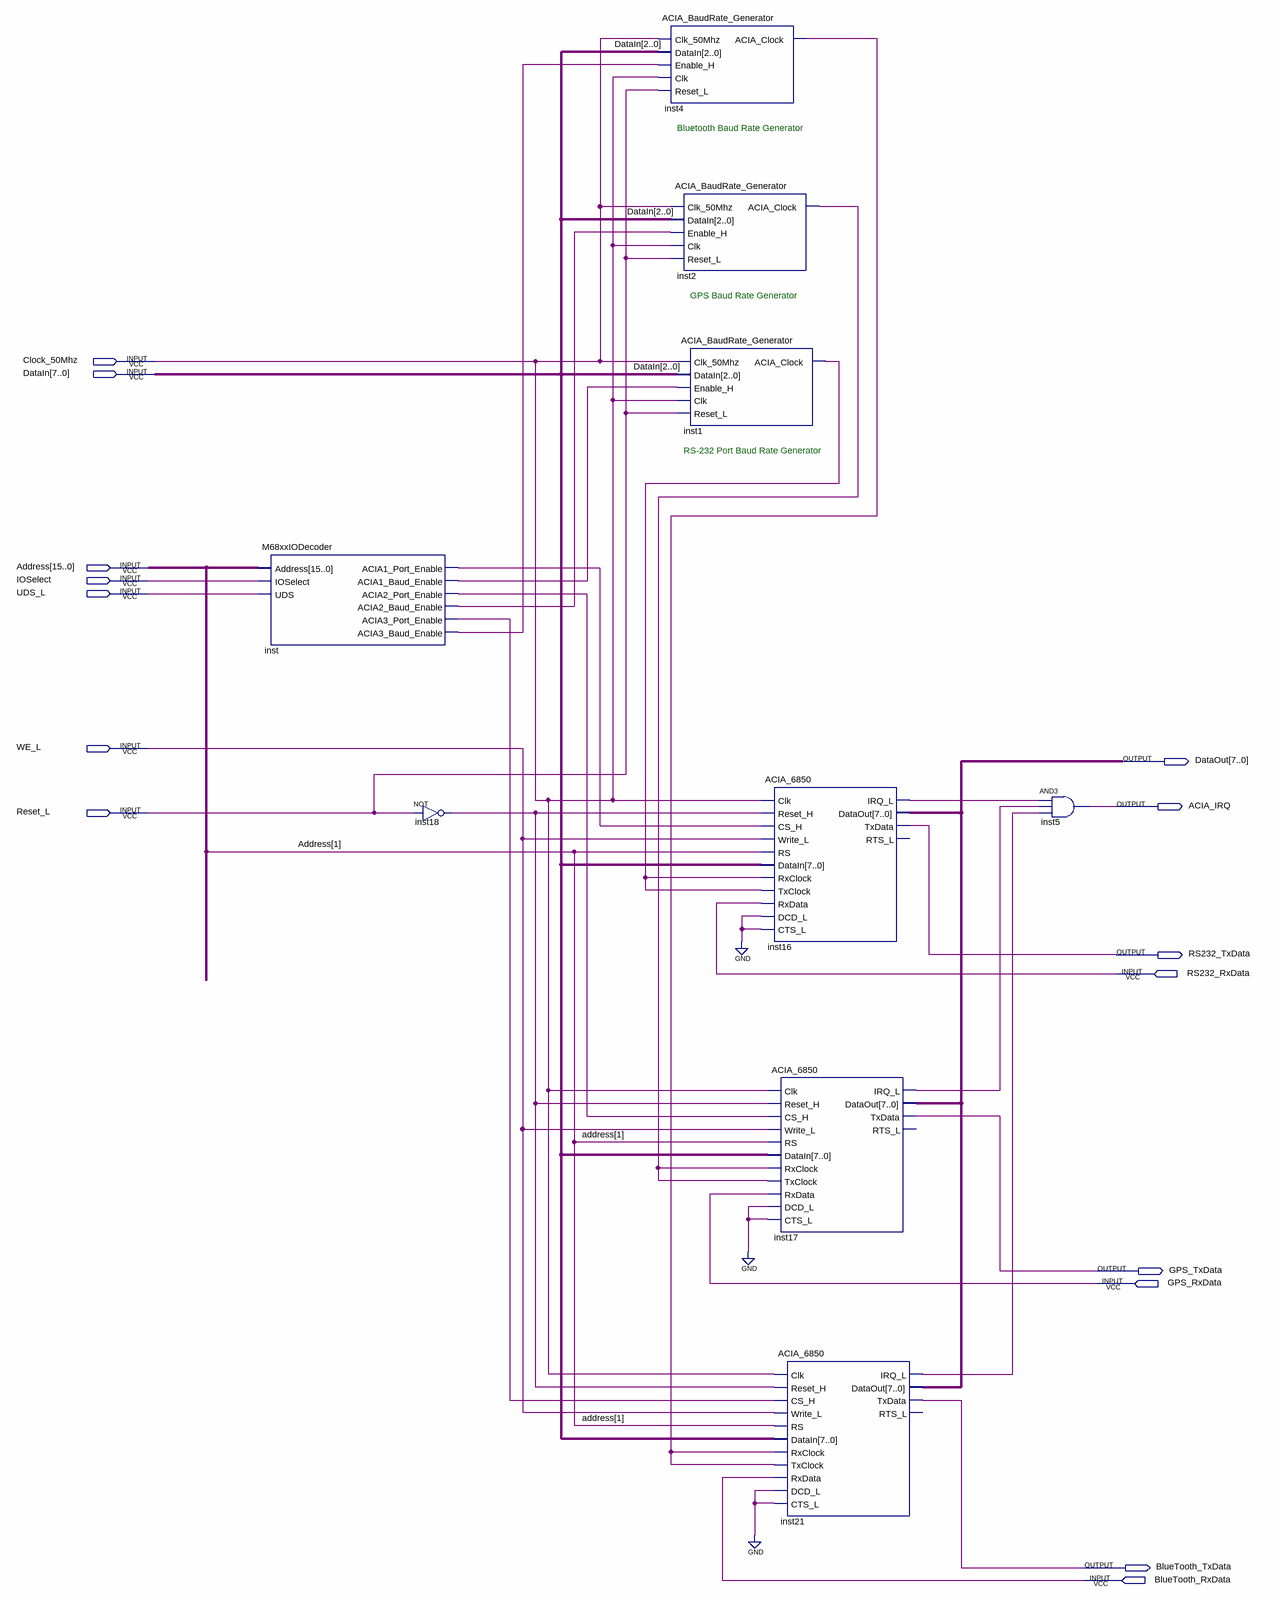
[diagram p0: schematic sheet]
// Quartus schematic OnChipM68xxIO.bdf as structural Verilog: 9 symbols, 15 pins
module OnChipM68xxIO (
  input  Clock_50Mhz,
  input  [7:0] DataIn,
  input  [15:0] Address,
  input  IOSelect,
  input  UDS_L,
  input  WE_L,
  input  Reset_L,
  input  RS232_RxData,
  input  GPS_RxData,
  input  BlueTooth_RxData,
  output [7:0] DataOut,
  output ACIA_IRQ,
  output RS232_TxData,
  output GPS_TxData,
  output BlueTooth_TxData
);

  wire inst1_acia_clock, inst2_acia_clock, inst4_acia_clock, inst16_irq_l, inst17_irq_l, inst18_out,
       inst21_irq_l, inst_acia1_baud_enable, inst_acia1_port_enable, inst_acia2_baud_enable,
       inst_acia2_port_enable, inst_acia3_baud_enable, inst_acia3_port_enable;

  M68xxIODecoder inst (
    .Address(Address), .IOSelect(IOSelect), .UDS(UDS_L), .ACIA1_Port_Enable(inst_acia1_port_enable),
    .ACIA1_Baud_Enable(inst_acia1_baud_enable), .ACIA2_Port_Enable(inst_acia2_port_enable),
    .ACIA2_Baud_Enable(inst_acia2_baud_enable), .ACIA3_Port_Enable(inst_acia3_port_enable),
    .ACIA3_Baud_Enable(inst_acia3_baud_enable));
  not inst18 (inst18_out, Reset_L);
  ACIA_BaudRate_Generator inst4 (
    .Clk_50Mhz(Clock_50Mhz), .DataIn(DataIn[2:0]), .Enable_H(inst_acia3_baud_enable), .Clk(Clock_50Mhz),
    .Reset_L(Reset_L), .ACIA_Clock(inst4_acia_clock));
  ACIA_BaudRate_Generator inst2 (
    .Clk_50Mhz(Clock_50Mhz), .DataIn(DataIn[2:0]), .Enable_H(inst_acia2_baud_enable), .Clk(Clock_50Mhz),
    .Reset_L(Reset_L), .ACIA_Clock(inst2_acia_clock));
  ACIA_BaudRate_Generator inst1 (
    .Clk_50Mhz(Clock_50Mhz), .DataIn(DataIn[2:0]), .Enable_H(inst_acia1_baud_enable), .Clk(Clock_50Mhz),
    .Reset_L(Reset_L), .ACIA_Clock(inst1_acia_clock));
  ACIA_6850 inst16 (
    .Clk(Clock_50Mhz), .Reset_H(inst18_out), .CS_H(inst_acia1_port_enable), .Write_L(WE_L), .RS(Address[1]),
    .DataIn(DataIn), .RxClock(inst1_acia_clock), .TxClock(inst1_acia_clock), .RxData(RS232_RxData),
    .DCD_L(1'b0), .CTS_L(1'b0), .IRQ_L(inst16_irq_l), .DataOut(DataOut), .TxData(RS232_TxData));  // open: RTS_L
  ACIA_6850 inst17 (
    .Clk(Clock_50Mhz), .Reset_H(inst18_out), .CS_H(inst_acia2_port_enable), .Write_L(WE_L), .RS(Address[1]),
    .DataIn(DataIn), .RxClock(inst2_acia_clock), .TxClock(inst2_acia_clock), .RxData(GPS_RxData),
    .DCD_L(1'b0), .CTS_L(1'b0), .IRQ_L(inst17_irq_l), .DataOut(DataOut), .TxData(GPS_TxData));  // open: RTS_L
  ACIA_6850 inst21 (
    .Clk(Clock_50Mhz), .Reset_H(inst18_out), .CS_H(inst_acia3_port_enable), .Write_L(WE_L), .RS(Address[1]),
    .DataIn(DataIn), .RxClock(inst4_acia_clock), .TxClock(inst4_acia_clock), .RxData(BlueTooth_RxData),
    .DCD_L(1'b0), .CTS_L(1'b0), .IRQ_L(inst21_irq_l), .DataOut(DataOut), .TxData(BlueTooth_TxData));  // open: RTS_L
  and inst5 (ACIA_IRQ, inst16_irq_l, inst17_irq_l, inst21_irq_l);

  // Notes on the sheet:
  //   Bluetooth Baud Rate Generator
  //   GPS Baud Rate Generator
  //   RS-232 Port Baud Rate Generator
endmodule
